# Altium schematic sheet root.SchDoc
size A4; SheetNumber: 1; SheetTotal: 9
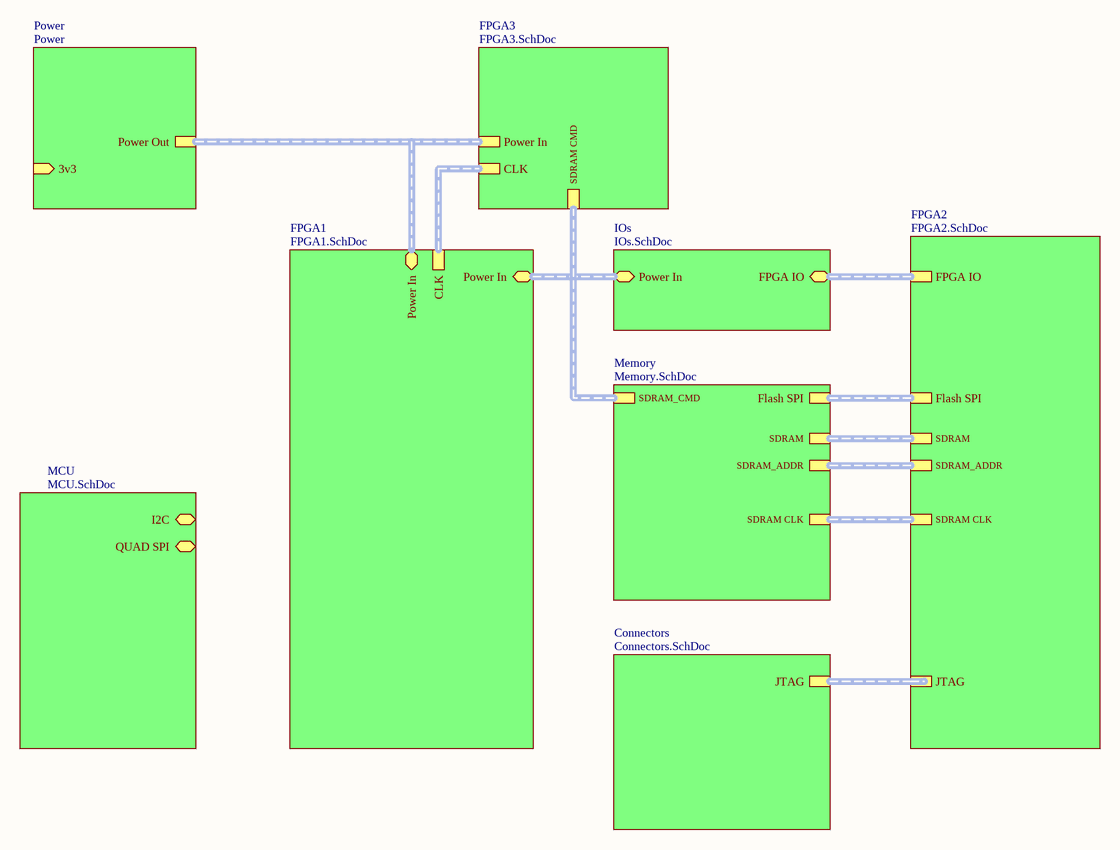
[diagram p0: root.SchDoc]

## Sub-sheets
Connectors = Connectors.SchDoc: JTAG
FPGA1 = FPGA1.SchDoc: Power In (bidir), CLK, Power In (bidir)
FPGA2 = FPGA2.SchDoc: FPGA IO, Flash SPI, SDRAM, SDRAM_ADDR, JTAG, SDRAM CLK
FPGA3 = FPGA3.SchDoc: Power In, CLK, SDRAM CMD
IOs = IOs.SchDoc: FPGA IO (bidir), Power In (bidir)
MCU = MCU.SchDoc: I2C (bidir), QUAD SPI (bidir)
Memory = Memory.SchDoc: Flash SPI, SDRAM, SDRAM_ADDR, SDRAM_CMD, SDRAM CLK
Power = Power: 3v3 (in), Power Out

## Buses and harness runs
harness sheet Connectors/JTAG = sheet FPGA2/JTAG
harness sheet FPGA1/CLK = sheet FPGA3/CLK
harness sheet FPGA1/Power In = sheet FPGA3/Power In = sheet Power/Power Out
harness sheet FPGA1/Power In = sheet IOs/Power In
harness sheet FPGA2/Flash SPI = sheet Memory/Flash SPI
harness sheet FPGA2/FPGA IO = sheet IOs/FPGA IO
harness sheet FPGA2/SDRAM = sheet Memory/SDRAM
harness sheet FPGA2/SDRAM CLK = sheet Memory/SDRAM CLK
harness sheet FPGA2/SDRAM_ADDR = sheet Memory/SDRAM_ADDR
harness sheet FPGA3/SDRAM CMD = sheet Memory/SDRAM_CMD